# Altium project PedalBoardV2_0.PrjPcb
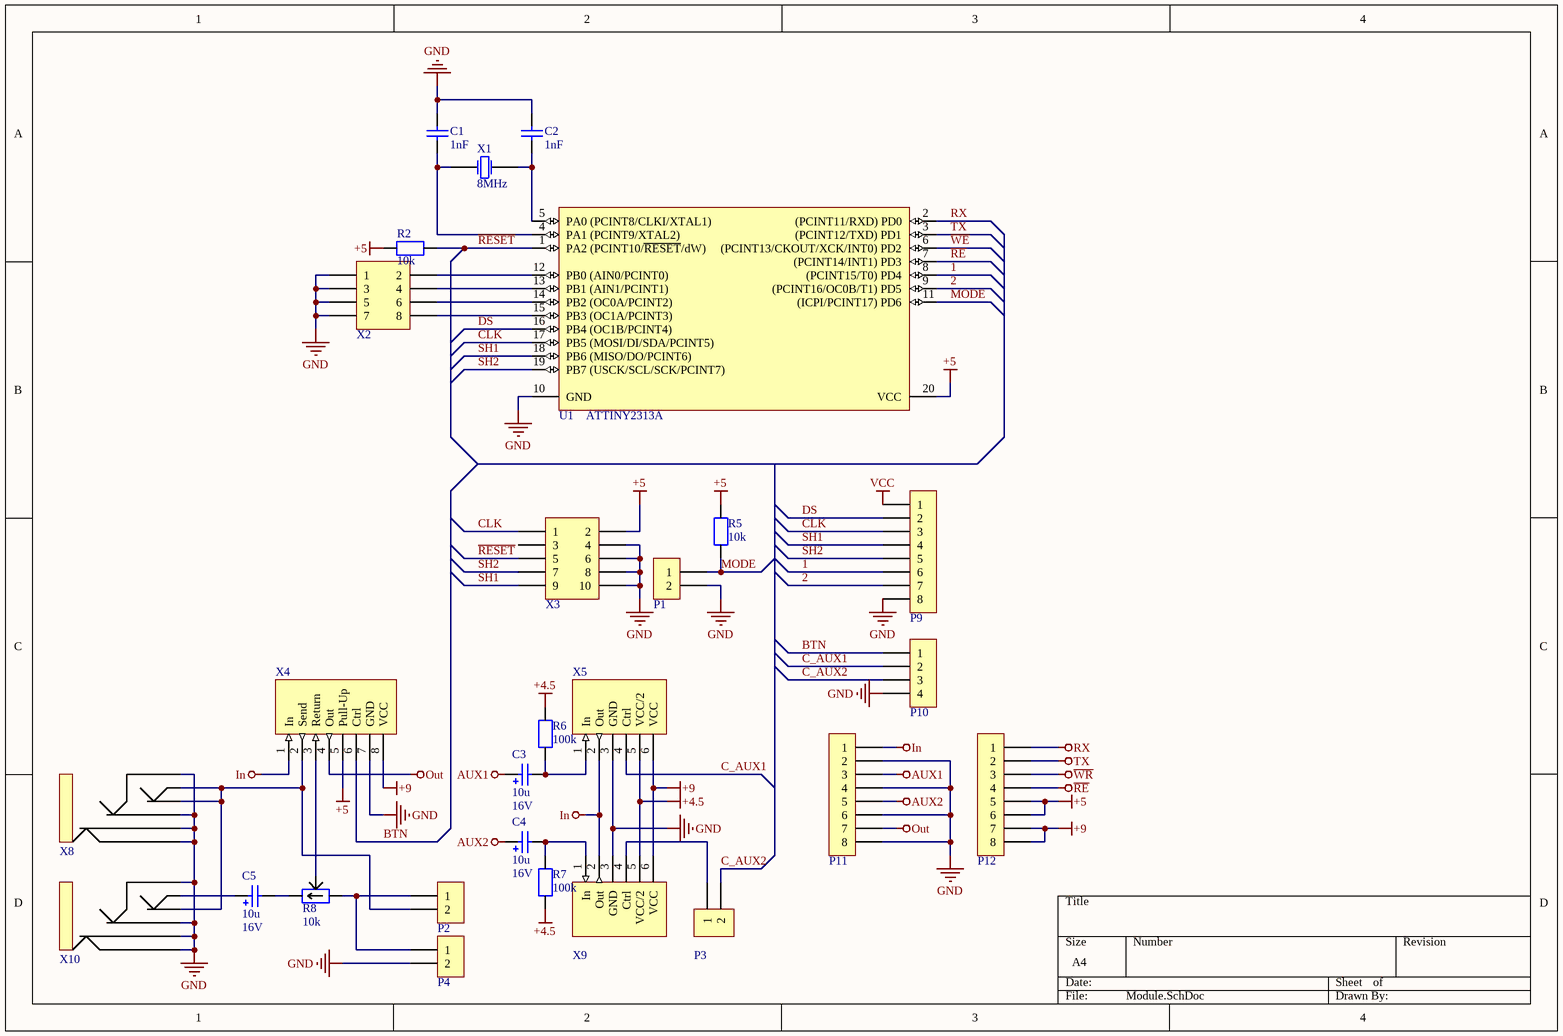
[diagram p0: Module.SchDoc]
2 sheets, 51 parts. Net scope: global (net labels, ports and power ports of the same name join across sheets).
Board files: Module.PcbDoc, Indicators.PcbDoc
Sheets:
  Module.SchDoc
  Indicators.SchDoc

## Sheet Module.SchDoc
size A4

### Parts
C1  value 1nF  [0805_Capacitor]  (hidden comment: Capacitor)
C2  value 1nF  [0805_Capacitor]  (hidden comment: Capacitor)
C3  value 10u  Initial Voltage: 16V  [ELEC_RAD10]  (hidden comment: Electrolytic Capacitor)
C4  value 10u  Initial Voltage: 16V  [ELEC_RAD10]  (hidden comment: Electrolytic Capacitor)
C5  value 10u  Initial Voltage: 16V  [ELEC_RAD10]  (hidden comment: Electrolytic Capacitor)
P1  SIL-CONN-2  [SIL-CONN-2-jumper]  (value not drawn)
P2  SIL-CONN-2  [SIL-CONN-2-jumper]  (value not drawn)
P3  SIL-CONN-2  [SIL-CONN-2-jumper]  (value not drawn)
P4  SIL-CONN-2  [SIL-CONN-2-jumper]  (value not drawn)
P9  SIL-CONN-8  [SIL-CONN-8]  (value not drawn)
P10  SIL-CONN-4  [SIL-CONN-4]  (value not drawn)
P11  SIL-CONN-8  [SIL-CONN-8]  (value not drawn)
P12  SIL-CONN-8  [SIL-CONN-8]  (value not drawn)
R2  value 10k  [0805_Resistor]  (hidden comment: Resistor)
R5  value 10k  [0805_Resistor]  (hidden comment: Resistor)
R6  value 100k  [0805_Resistor]  (hidden comment: Resistor)
R7  value 100k  [0805_Resistor]  (hidden comment: Resistor)
R8  value 10k  [Variable Resistor]  (hidden comment: Variable Resistor)
U1  ATTINY2313A  [SOIC20]
X1  Frequency: 8MHz  [HC49]  (hidden comment: Crystal)
X2  DIL-CONN-8  [DIL-CONN-IDC-8]  (value not drawn)
X3  DIL-CONN-10  [DIL-CONN-IDC-10]  (value not drawn)
X4  MOSFET_Switch_Serial  [MOSFET_Switch_Serial]  (value not drawn)
X5  MOSFET_Switch_Parallel  [MOSFET_Switch_Parallel]  (value not drawn)
X8  Jack 6.3  [Jack 6.3]  (value not drawn)
X9  MOSFET_Switch_Parallel  [MOSFET_Switch_Parallel]  (value not drawn)
X10  Jack 6.3  [Jack 6.3]  (value not drawn)

### Nets
+4.5: R6.2 R7.1 X5.5(VCC/2) X9.5(VCC/2)
+5: P12.5 P12.6 R2.2 R5.2 U1.20(VCC) X3.2 X4.5(Pull-Up)
+9: P12.7 P12.8 X4.8(VCC) X5.6(VCC) X9.6(VCC)
AUX1: C3.+ P11.3
AUX2: C4.+ P11.5
GND: C1.2 C2.2 P1.2 P4.2 P9.8 P10.4 P11.2 P11.4 P11.6 P11.8 U1.10(GND) X2.1 X2.3 X2.5 X2.7 X3.4 X3.6 X3.8 X3.10 X4.7(GND) X5.3(GND) X8.3 X8.4 X8.5 X8.6 X9.3(GND) X10.3 X10.4 X10.5 X10.6
In: P11.1 X4.1(In) X5.2(Out) X9.2(Out)
Out: P11.7 X4.4(Out)
~{RE}: P12.4 U1.7((PCINT14/INT1)_PD3)
RX: P12.1 U1.2((PCINT11/RXD)_PD0)
TX: P12.2 U1.3((PCINT12/TXD)_PD1)
VCC: P9.1
~{WR}: P12.3
1: P9.6 U1.8((PCINT15/T0)_PD4)
2: P9.7 U1.9((PCINT16/OC0B/T1)_PD5)
BTN: P10.1 X4.6(Ctrl)
C_AUX1: P10.2 X5.4(Ctrl)
C_AUX2: P3.2 P10.3
CLK: P9.3 U1.17(PB5_(MOSI/DI/SDA/PCINT5)) X3.1
DS: P9.2 U1.16(PB4_(OC1B/PCINT4))
MODE: P1.1 R5.1 U1.11((ICPI/PCINT17)_PD6)
~{RESET}: R2.1 U1.1(PA2_(PCINT10/~{RESET}/dW)) X3.5
SH1: P9.4 U1.18(PB6_(MISO/DO/PCINT6)) X3.9
SH2: P9.5 U1.19(PB7_(USCK/SCL/SCK/PCINT7)) X3.7
~{WE}: U1.6((PCINT13/CKOUT/XCK/INT0)_PD2)
NetC1_1: C1.1 U1.4(PA1_(PCINT9/XTAL2)) X1.1
NetC2_1: C2.1 U1.5(PA0_(PCINT8/CLKI/XTAL1)) X1.2
NetC3_-: C3.- R6.1 X5.1(In)
NetC4_-: C4.- R7.2 X9.1(In)
NetC5_+: C5.+ X10.1
NetC5_-: C5.- R8.2
NetP2_1: P2.1 P4.1 R8.1
NetP2_2: P2.2 X4.2(Send) X8.1 X8.2 X10.2
NetP3_1: P3.1 X9.4(Ctrl)
NetR8_3: R8.3 X4.3(Return)
NetU1_12: U1.12(PB0_(AIN0/PCINT0)) X2.2
NetU1_13: U1.13(PB1_(AIN1/PCINT1)) X2.4
NetU1_14: U1.14(PB2_(OC0A/PCINT2)) X2.6
NetU1_15: U1.15(PB3_(OC1A/PCINT3)) X2.8

Not connected (* = marked no-connect by the designer): X3 3

## Sheet Indicators.SchDoc
size A4
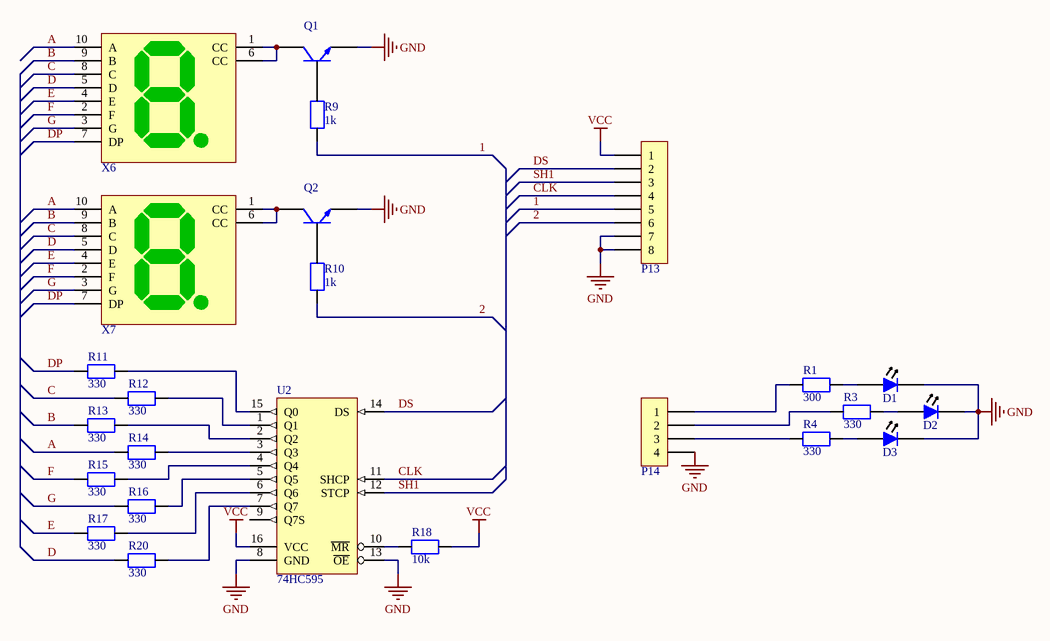
[diagram p1: Indicators.SchDoc]

### Parts
D1  LED  [LED]  (value not drawn)
D2  LED  [LED]  (value not drawn)
D3  LED  [LED]  (value not drawn)
P13  SIL-CONN-8  [SIL-CONN-8-R1]  (value not drawn)
P14  SIL-CONN-4  [SIL-CONN-4-R1]  (value not drawn)
Q1  KT315  [KT315]  (value not drawn)
Q2  KT315  [KT315]  (value not drawn)
R1  value 300  [0805_Resistor]  (hidden comment: Resistor)
R3  value 330  [0805_Resistor]  (hidden comment: Resistor)
R4  value 330  [0805_Resistor]  (hidden comment: Resistor)
R9  value 1k  [0805_Resistor]  (hidden comment: Resistor)
R10  value 1k  [0805_Resistor]  (hidden comment: Resistor)
R11  value 330  [0805_Resistor]  (hidden comment: Resistor)
R12  value 330  [0805_Resistor]  (hidden comment: Resistor)
R13  value 330  [0805_Resistor]  (hidden comment: Resistor)
R14  value 330  [0805_Resistor]  (hidden comment: Resistor)
R15  value 330  [0805_Resistor]  (hidden comment: Resistor)
R16  value 330  [0805_Resistor]  (hidden comment: Resistor)
R17  value 330  [0805_Resistor]  (hidden comment: Resistor)
R18  value 10k  [0805_Resistor]  (hidden comment: Resistor)
R20  value 330  [0805_Resistor]  (hidden comment: Resistor)
U2  74HC595  [SOIC16]
X6  FYS-3912  [FYS-3916]  (value not drawn)
X7  FYS-3912  [FYS-3916]  (value not drawn)

### Nets
GND: D1.K D2.K D3.K P13.7 P13.8 P14.4 Q1.E Q2.E U2.8(GND) U2.13(~{OE})
VCC: P13.1 R18.1 U2.16(VCC)
1: P13.5 R9.1
2: P13.6 R10.1
A: R14.2 X6.10(A) X7.10(A)
B: R13.2 X6.9(B) X7.9(B)
C: R12.2 X6.8(C) X7.8(C)
CLK: P13.4 U2.11(SHCP)
D: R20.2 X6.5(D) X7.5(D)
DP: R11.2 X6.7(DP) X7.7(DP)
DS: P13.2 U2.14(DS)
E: R17.2 X6.4(E) X7.4(E)
F: R15.2 X6.2(F) X7.2(F)
G: R16.2 X6.3(G) X7.3(G)
SH1: P13.3 U2.12(STCP)
NetD1_A: D1.A R1.1
NetD2_A: D2.A R3.1
NetD3_A: D3.A R4.1
NetP14_1: P14.1 R1.2
NetP14_2: P14.2 R3.2
NetP14_3: P14.3 R4.2
NetQ1_B: Q1.B R9.2
NetQ1_K: Q1.K X6.1(CC) X6.6(CC)
NetQ2_B: Q2.B R10.2
NetQ2_K: Q2.K X7.1(CC) X7.6(CC)
NetR11_1: R11.1 U2.15(Q0)
NetR12_1: R12.1 U2.1(Q1)
NetR13_1: R13.1 U2.2(Q2)
NetR14_1: R14.1 U2.3(Q3)
NetR15_1: R15.1 U2.4(Q4)
NetR16_1: R16.1 U2.5(Q5)
NetR17_1: R17.1 U2.6(Q6)
NetR18_2: R18.2 U2.10(~{MR})
NetR20_1: R20.1 U2.7(Q7)

Not connected (* = marked no-connect by the designer): U2 9(Q7S)

### Library data of the parts
Q1 Q2 = KT315: pin to pad: B>3 E>1 K>2

## Nets that join several sheets
GND: Module (30 pins), Indicators (10 pins)
VCC: Module (P9.1), Indicators (P13.1 R18.1 U2.16)
1: Module (P9.6 U1.8), Indicators (P13.5 R9.1)
2: Module (P9.7 U1.9), Indicators (P13.6 R10.1)
CLK: Module (P9.3 U1.17 X3.1), Indicators (P13.4 U2.11)
DS: Module (P9.2 U1.16), Indicators (P13.2 U2.14)
SH1: Module (P9.4 U1.18 X3.9), Indicators (P13.3 U2.12)